# EAGLE schematic TopPanelV3.2 (EAGLE 7.3.0)
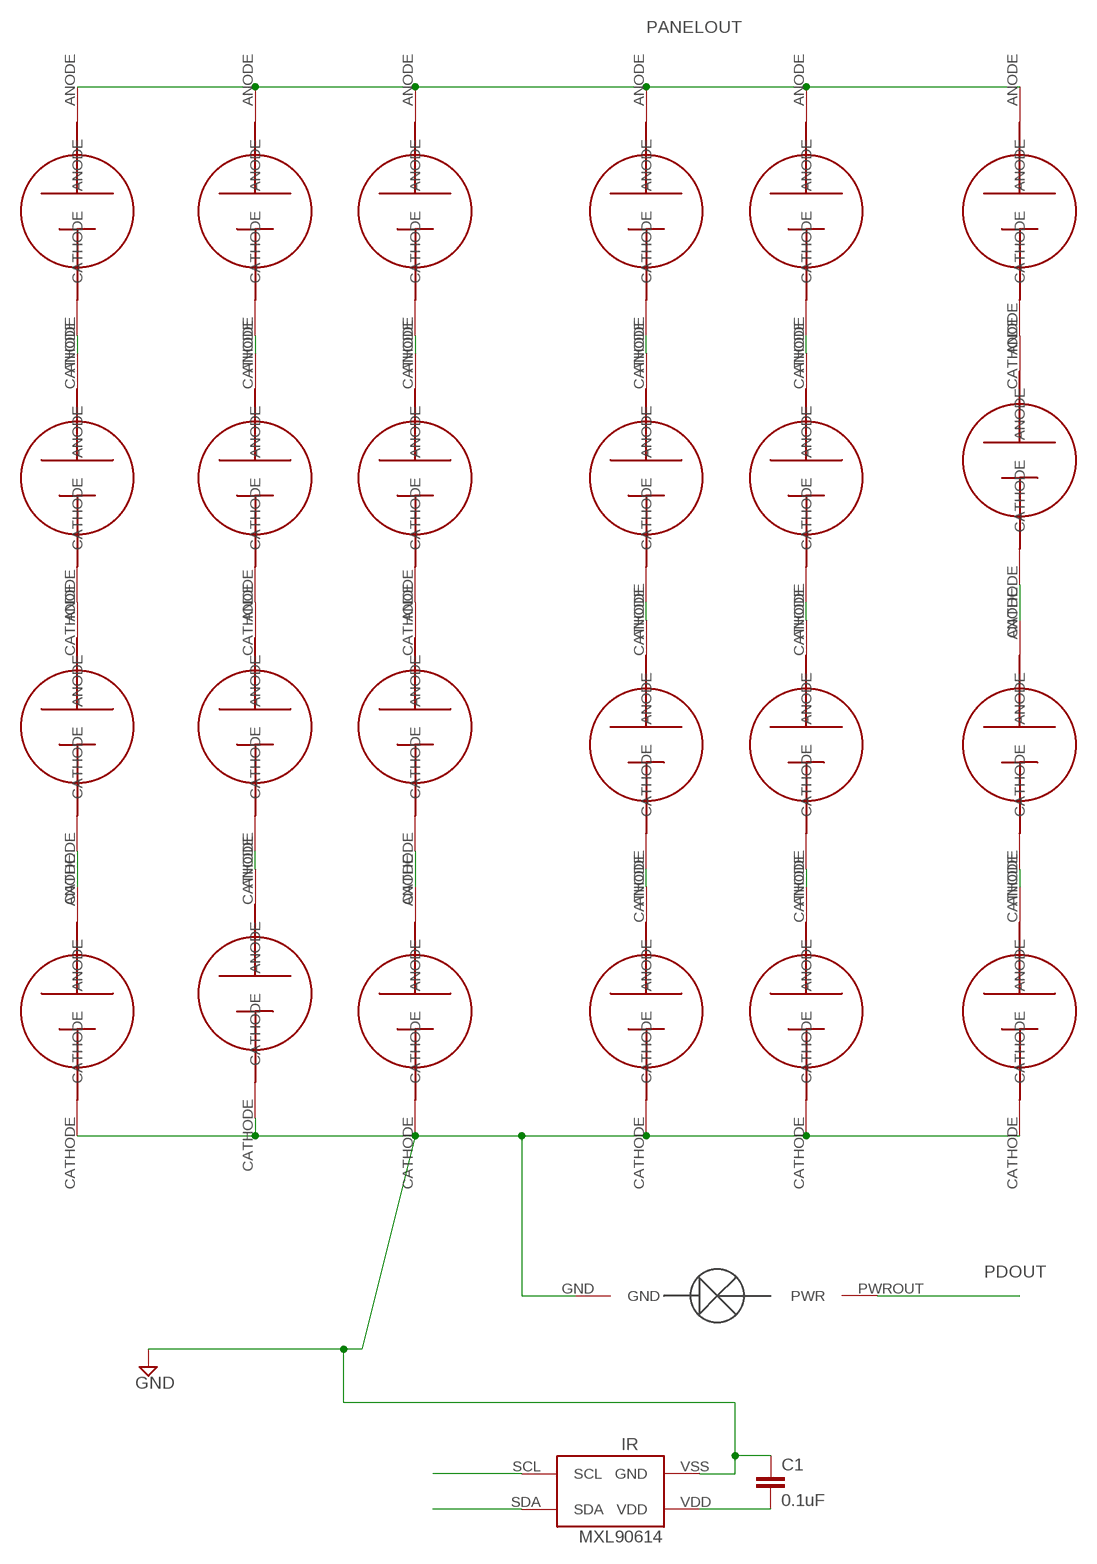
[diagram p0: schematic, sheet 1]

## Parts
1A  SOLARCELL  [SOLARCELL]
1B  SOLARCELL  [SOLARCELL]
1C  SOLARCELL  [SOLARCELL]
1D  SOLARCELL  [SOLARCELL]
2A  SOLARCELL  [SOLARCELL]
2B  SOLARCELL  [SOLARCELL]
2C  SOLARCELL  [SOLARCELL]
2D  SOLARCELL  [SOLARCELL]
3A  SOLARCELL  [SOLARCELL]
3B  SOLARCELL  [SOLARCELL]
3C  SOLARCELL  [SOLARCELL]
3D  SOLARCELL  [SOLARCELL]
4A  SOLARCELL  [SOLARCELL]
4B  SOLARCELL  [SOLARCELL]
4C  SOLARCELL  [SOLARCELL]
4D  SOLARCELL  [SOLARCELL]
5A  SOLARCELL  [SOLARCELL]
5B  SOLARCELL  [SOLARCELL]
5C  SOLARCELL  [SOLARCELL]
5D  SOLARCELL  [SOLARCELL]
6A  SOLARCELL  [SOLARCELL]
6B  SOLARCELL  [SOLARCELL]
6C  SOLARCELL  [SOLARCELL]
6D  SOLARCELL  [SOLARCELL]
C1  0.1uF  CAP0805  [0805]
IR  MXL90620  [MXL90614]
U$1  PHOTODETECTOR  [PHOTODECTORDEVICE2]

## Nets
3V3: C1.2 IR.VDD
GND: 1D.CATHODE 2D.CATHODE 3D.CATHODE 4D.CATHODE 5D.CATHODE 6D.CATHODE C1.1 IR.VSS(GND) U$1.GND
N$1: 1A.CATHODE 1B.ANODE
N$2: 1C.CATHODE 1D.ANODE
N$3: 2A.CATHODE 2B.ANODE
N$4: 2C.CATHODE 2D.ANODE
N$5: 3C.CATHODE 3D.ANODE
N$6: 4A.CATHODE 4B.ANODE
N$7: 4C.CATHODE 4D.ANODE
N$8: 5A.CATHODE 5B.ANODE
N$9: 5C.CATHODE 5D.ANODE
N$10: 6A.CATHODE 6B.ANODE
N$11: 6C.CATHODE 6D.ANODE
N$12: 1B.CATHODE 1C.ANODE
N$13: 2B.CATHODE 2C.ANODE
N$14: 3A.CATHODE 3B.ANODE
N$15: 3B.CATHODE 3C.ANODE
N$16: 4B.CATHODE 4C.ANODE
N$17: 5B.CATHODE 5C.ANODE
N$18: 6B.CATHODE 6C.ANODE
PANELOUT: 1A.ANODE 2A.ANODE 3A.ANODE 4A.ANODE 5A.ANODE 6A.ANODE
PDOUT: U$1.PWROUT(PWR)
SCL: IR.SCL
SDA: IR.SDA

## Library data of the parts
1A 1B 1C 1D 2A 2B 2C 2D 3A 3B 3C 3D 4A 4B 4C 4D 5A 5B 5C 5D 6A 6B 6C 6D = SolarCellTASCMirror:SOLARCELL
C1 = CNTRL_BOARD:CAP: Capacitor Standard 0603 ceramic capacitor, and 0.1" leaded capacitor.
IR = CNTRL_BOARD:MXL90620
U$1 = solarcellnew:PHOTODETECTOR